# EAGLE design Shield_v1 (EAGLE 7.7.0)
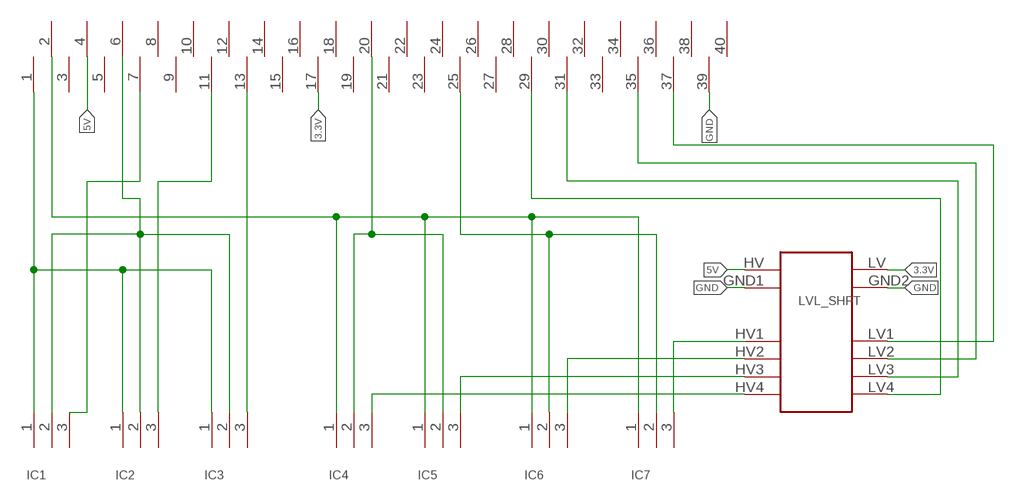
[diagram p0: schematic, sheet 1]

## Parts
IC1  3,5MM_3PIN  [3,5MM_3PIN]
IC2  3,5MM_3PIN  [3,5MM_3PIN]
IC3  3,5MM_3PIN  [3,5MM_3PIN]
IC4  3,5MM_3PIN  [3,5MM_3PIN]
IC5  3,5MM_3PIN  [3,5MM_3PIN]
IC6  3,5MM_3PIN  [3,5MM_3PIN]
IC7  3,5MM_3PIN  [3,5MM_3PIN]
IC17  40_PIN_2.54MM  [40_PIN_2.54MM]
LVL_SHFT  LVL_SHIFTER_4CH  [LVL_SHIFTER_4CH]

## Nets
3.3V: IC17.17 LVL_SHFT.LV
5V: IC17.4 LVL_SHFT.HV
GND: IC17.39 LVL_SHFT.GND1 LVL_SHFT.GND2
N$1: IC1.1 IC2.1 IC3.1 IC17.1
N$2: IC4.1 IC5.1 IC6.1 IC7.1 IC17.2
N$3: IC1.2 IC2.2 IC3.2 IC17.6
N$4: IC4.2 IC5.2 IC17.20
N$5: IC6.2 IC7.2 IC17.25
N$6: IC7.3 LVL_SHFT.HV1
N$7: IC6.3 LVL_SHFT.HV2
N$8: IC5.3 LVL_SHFT.HV3
N$9: IC4.3 LVL_SHFT.HV4
N$10: IC17.37 LVL_SHFT.LV1
N$11: IC17.35 LVL_SHFT.LV2
N$12: IC17.31 LVL_SHFT.LV3
N$13: IC17.29 LVL_SHFT.LV4
N$14: IC1.3 IC17.7
N$15: IC2.3 IC17.11
N$16: IC3.3 IC17.13
Unconnected: IC17.3 IC17.5 IC17.8 IC17.9 IC17.10 IC17.12 IC17.14 IC17.15 IC17.16 IC17.18 IC17.19 IC17.21 IC17.22 IC17.23 IC17.24 IC17.26 IC17.27 IC17.28 IC17.30 IC17.32 IC17.33 IC17.34 IC17.36 IC17.38 IC17.40

## Library data of the parts
IC1-IC7 = Screw_connector:3,5MM_3PIN
IC17 = 40goldpin_2_54mm:40_PIN_2.54MM
LVL_SHFT = level_shifter_MOD12:LVL_SHIFTER_4CH

## Board
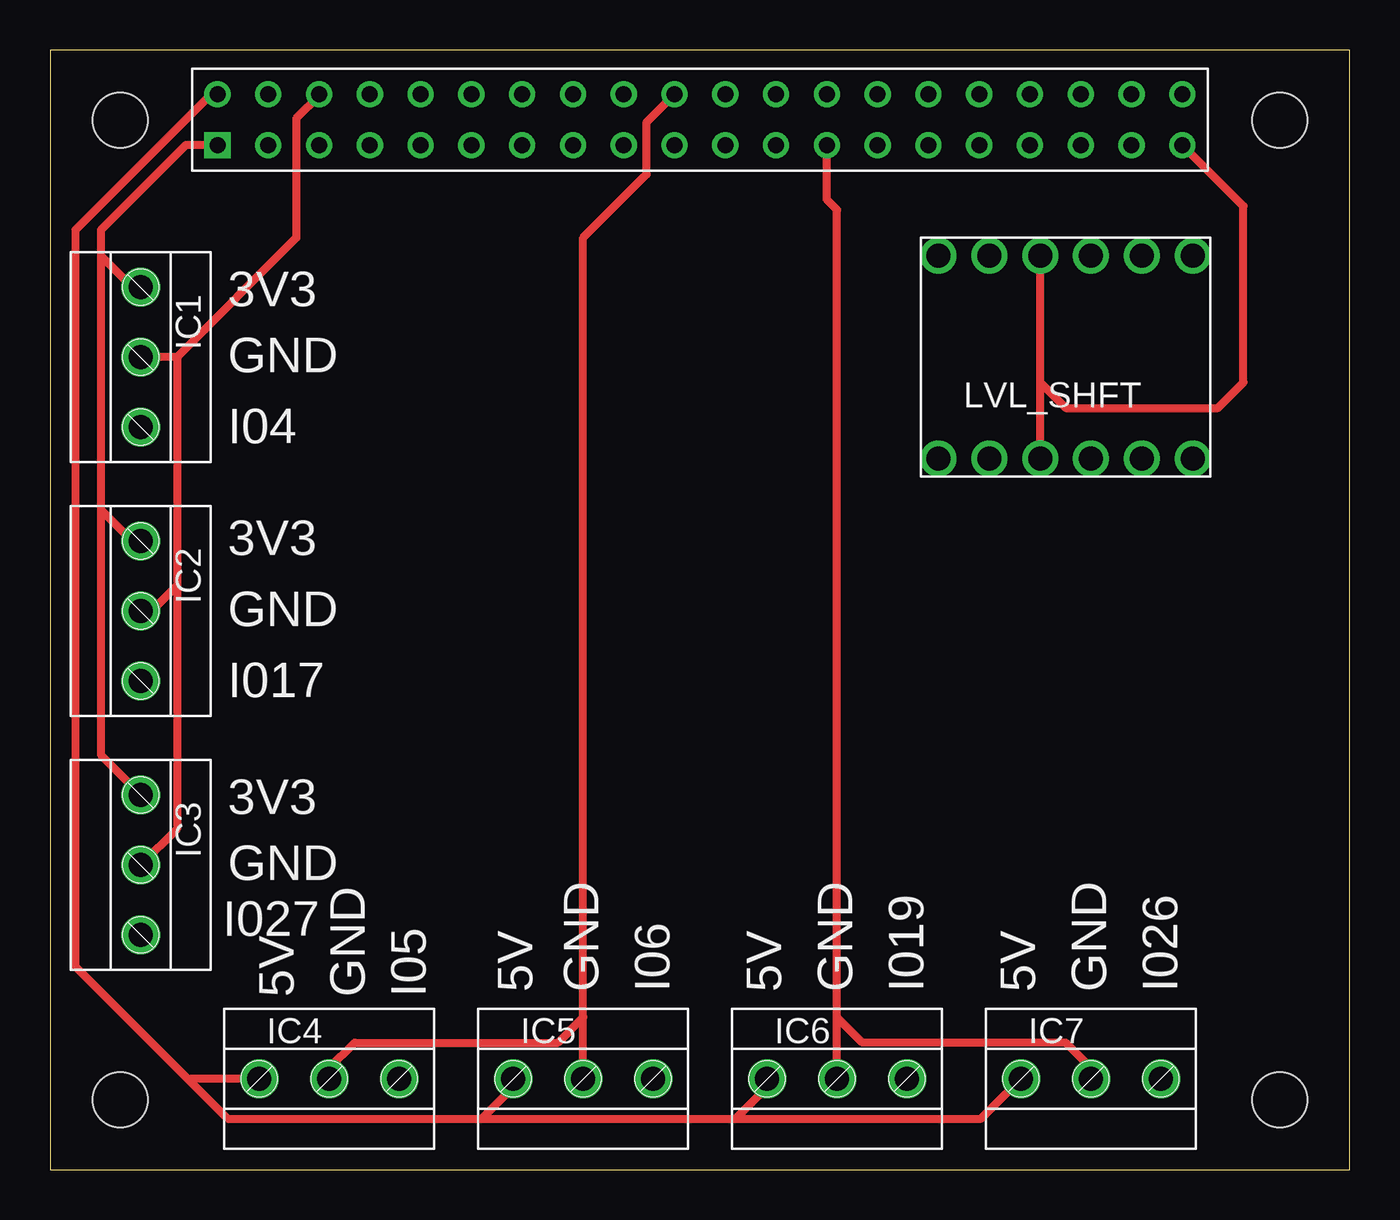
[diagram p1: board, top side]
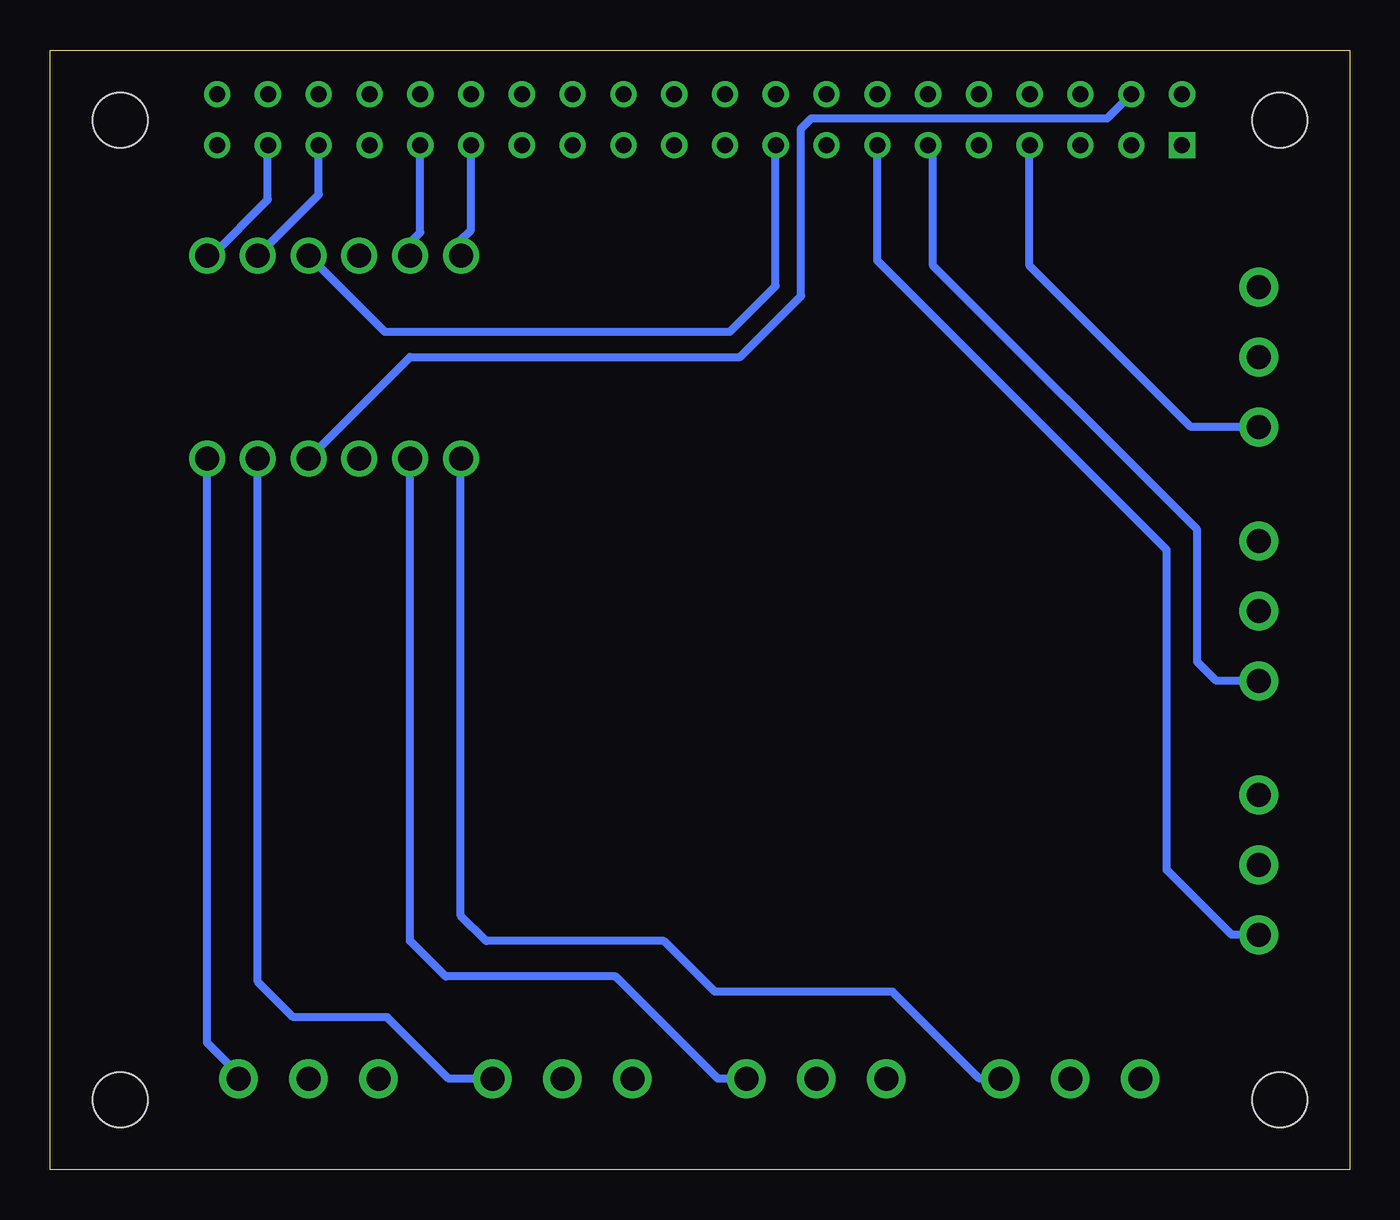
[diagram p2: board, bottom side, seen from below]

Size 65 x 56 mm. Coordinates in mm from the lower left corner, seen from the top.
Outline: 0,0 65,0 65,56 0,56 0,0
Copper layers (1*16): Top 0.035mm / dielectric 1.5mm / Bottom 0.035mm
Design rules "default *": minimum track width 15mil, minimum drill 24mil, track to track 10mil, track to pad 8mil, pad to pad 8mil, via to via 8mil, smd to smd 8mil, copper to edge 20mil, drill to drill 8mil, minimum pad ring 10mil, minimum via ring 8mil, stop-mask expansion 4mil, vias tented up to drill 0mil, thermal gap 10mil
Holes 2.75 mm at 3.5,3.5 3.5,52.5 61.5,52.5 61.5,3.5

### Footprints (pad centres in the part's own frame; a part is rotated, then mirrored left to right if it is on the bottom)
3,5MM_3PIN = drill 1.2 pad 1.93: 1 -3.5,2; 2 0,2; 3 3.5,2
40_PIN_2.54MM = drill 0.8 square: 1 -24.13,-1.27 | drill 0.8: 2 -24.13,1.27; 3 -21.59,-1.27; 4 -21.59,1.27; 5 -19.05,-1.27; 6 -19.05,1.27; 7 -16.51,-1.27; 8 -16.51,1.27; 9 -13.97,-1.27; 10 -13.97,1.27; 11 -11.43,-1.27; 12 -11.43,1.27; 13 -8.89,-1.27; 14 -8.89,1.27; 15 -6.35,-1.27; 16 -6.35,1.27; 17 -3.81,-1.27; 18 -3.81,1.27; 19 -1.27,-1.27; 20 -1.27,1.27; 21 1.27,-1.27; 22 1.27,1.27; 23 3.81,-1.27; 24 3.81,1.27; 25 6.35,-1.27; 26 6.35,1.27; 27 8.89,-1.27; 28 8.89,1.27; 29 11.43,-1.27; 30 11.43,1.27; 31 13.97,-1.27; 32 13.97,1.27; 33 16.51,-1.27; 34 16.51,1.27; 35 19.05,-1.27; 36 19.05,1.27; 37 21.59,-1.27; 38 21.59,1.27; 39 24.13,-1.27; 40 24.13,1.27
LVL_SHIFTER_4CH = drill 1.2 pad 1.778: GND1 1.27,5.08; GND2 1.27,-5.08; HV -1.27,5.08; HV1 -6.35,5.08; HV2 -3.81,5.08; HV3 3.81,5.08; HV4 6.35,5.08; LV -1.27,-5.08; LV1 -6.35,-5.08; LV2 -3.81,-5.08; LV3 3.81,-5.08; LV4 6.35,-5.08

### Placement (x,y rotation side)
IC1  2.54,40.64 270 top
IC2  2.54,27.94 270 top
IC3  2.54,15.24 270 top
IC4  13.97,2.54 0 top
IC5  26.67,2.54 0 top
IC6  39.37,2.54 0 top
IC7  52.07,2.54 0 top
IC17  32.51,52.51 0 top
LVL_SHFT  50.8,40.64 180 top

### Tracks (layer width: path | path; a pad name or v marks a point on that pad's centre or on a via)
3.3V
  Bottom 0.406: LVL_SHFT.LV 48.26,41.91 30.99,41.91 28.7,44.2 IC17.17
5V
  Bottom 0.406: LVL_SHFT.HV 46.99,40.64 30.48,40.64 27.43,43.69 27.43,52.07 26.92,52.58 12.12,52.58 IC17.4
GND
  Top 0.406: LVL_SHFT.GND1 49.53,39.37 | 49.53,39.37 LVL_SHFT.GND2 | IC17.39 59.69,48.19 59.69,39.37 58.42,38.1 50.8,38.1 49.53,39.37
N$1
  Top 0.406: IC17.1 6.79,51.24 2.54,46.99 2.54,45.72 | 2.54,45.72 2.54,33.02 | 2.54,33.02 2.54,20.74 IC3.1 | IC2.1 4.12,31.44 2.54,33.02 | IC1.1 4.12,44.14 2.54,45.72
N$2
  Top 0.406: IC17.2 8.06,53.78 1.27,46.99 1.27,10.16 6.99,4.45 | 21.59,2.54 8.89,2.54 6.99,4.45 | 21.59,2.54 34.29,2.54 | 34.29,2.54 46.57,2.54 IC7.1 | IC6.1 35.87,4.12 34.29,2.54 | IC5.1 23.17,4.12 21.59,2.54 | IC4.1 7.08,4.54 6.99,4.45
N$3
  Top 0.406: IC17.6 13.46,53.72 12.32,52.58 12.32,46.61 6.35,40.64 | 6.35,40.64 6.35,29.21 | 6.35,29.21 6.35,17.05 IC3.2 | IC2.2 5.08,27.94 6.35,29.21 | 6.35,40.64 IC1.2
N$4
  Top 0.406: IC4.2 13.97,5.08 15.24,6.35 25.4,6.35 26.67,7.62 | IC5.2 26.67,7.62 | 26.67,7.62 26.67,46.61 29.84,49.78 29.84,52.39 IC17.20
N$5
  Top 0.406: IC7.2 52.07,5.08 50.8,6.35 40.64,6.35 39.37,7.62 | IC6.2 39.37,7.62 | 39.37,7.62 39.37,48.01 38.86,48.51 IC17.25
N$6
  Bottom 0.406: IC7.3 55.57,4.77 57.15,6.35 LVL_SHFT.HV1
N$7
  Bottom 0.406: IC6.3 45.05,4.54 48.13,7.62 52.83,7.62 54.61,9.4 LVL_SHFT.HV2
N$8
  Bottom 0.406: IC5.3 31.59,4.54 36.7,9.65 | 36.7,9.65 45.21,9.65 | 45.21,9.65 46.99,11.43 LVL_SHFT.HV3 | 36.7,9.65 45.21,9.65
N$9
  Bottom 0.406: IC4.3 18.51,4.54 22.86,8.89 31.75,8.89 34.29,11.43 43.18,11.43 44.45,12.7 LVL_SHFT.HV4
N$10
  Bottom 0.406: LVL_SHFT.LV1 56.9,45.72 54.1,48.51 IC17.37
N$11
  Bottom 0.406: LVL_SHFT.LV2 51.56,48.77 IC17.35
N$12
  Bottom 0.406: LVL_SHFT.LV3 46.99,46.35 46.48,46.86 IC17.31
N$13
  Bottom 0.406: LVL_SHFT.LV4 44.45,46.48 43.94,46.99 IC17.29
N$14
  Bottom 0.406: IC1.3 7.93,37.14 16,45.21 IC17.7
N$15
  Bottom 0.406: IC2.3 6.66,24.44 7.62,25.4 7.62,32 20.83,45.21 20.83,50.99 IC17.11
N$16
  Bottom 0.406: IC3.3 5.9,11.74 9.14,14.99 9.14,30.99 23.62,45.47 IC17.13

### Text on the board
tNames: 3V3 | GND | I04 | 3V3 | GND | I017 | 3V3 | GND | I027 | 5V | GND | I05 | 5V | GND | I06 | 5V | GND | I019 | 5V | GND | I026